# EAGLE design driveher (EAGLE 6.4)
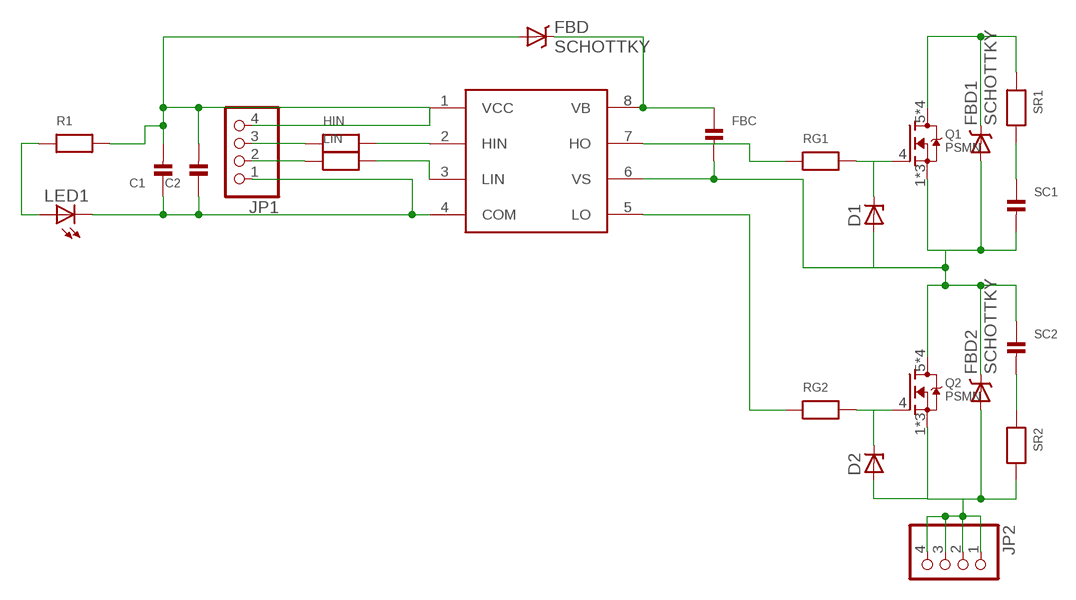
[diagram p0: schematic, sheet 1]

## Parts
C1  CAP_CERAMIC1206  [1206]
C2  CAP_CERAMIC1206  [1206]
D1  ZENER-DIODESOT23  [SOT23]
D2  ZENER-DIODESOT23  [SOT23]
FBC  CAP_CERAMIC1206  [1206]
FBD  SCHOTTKY  [SMA-DIODE]
FBD1  SCHOTTKY  [SMA-DIODE]
FBD2  SCHOTTKY  [SMA-DIODE]
HIN  RESISTOR0603  [0603]
JP1  HEADER-1X4ROUND  [1X04_ROUND]
JP2  HEADER-1X4ROUND  [1X04_ROUND]
LED1  LEDCHIPLED_0603  [CHIPLED_0603]
LIN  RESISTOR0603  [0603]
Q1  PSMN  [SO-08]
Q2  PSMN  [SO-08]
R1  RESISTOR0603  [0603]
RG1  RESISTOR0603  [0603]
RG2  RESISTOR0603  [0603]
SC1  CAP_CERAMIC0603  [0603]
SC2  CAP_CERAMIC0603  [0603]
SR1  RESISTOR0603  [0603]
SR2  RESISTOR0603  [0603]
U$1  IRS218-67  [SO-08]

## Nets
12V: C1.2 C2.2 FBD.A JP1.4 R1.2 U$1.1(VCC)
FLOAT: FBC.1 FBD.C U$1.8(VB)
G1: D1.3(C) Q1.4(G) RG1.2
G2: D2.3(C) Q2.4(G) RG2.2
GND: C1.1 C2.1 D2.1(A) FBD2.A JP1.1 JP2.1 JP2.2 JP2.3 JP2.4 LED1.C Q2.1(S) Q2.2(S) Q2.3(S) SR2.2 U$1.4(COM)
HIN-P: HIN.2 U$1.2(HIN)
HOUT: RG1.1 U$1.7(HO)
LIN-P: LIN.2 U$1.3(LIN)
LOUT: RG2.1 U$1.5(LO)
N$1: LED1.A R1.1
N$2: SC1.1 SR1.2
N$3: HIN.1 JP1.3
N$4: JP1.2 LIN.1
OUT: D1.1(A) FBC.2 FBD1.A FBD2.C Q1.1(S) Q1.2(S) Q1.3(S) Q2.5(D) Q2.6(D) Q2.7(D) Q2.8(D) SC1.2 SC2.1 U$1.6(VS)
P2: SC2.2 SR2.1
V+: FBD1.C Q1.5(D) Q1.6(D) Q1.7(D) Q1.8(D) SR1.1

## Library data of the parts
C1 C2 FBC SC1 SC2 = nonolith:CAP_CERAMIC: Ceramic Capacitors 0402 - 0402 Surface Mount Capacitors 0.1uF 10V 10% [Digikey: 490-1318-2-ND] 0603 - 0603 Surface Mount Capacitors 16 pF 50V 5% [Digikey: 445-5051-2-ND] 22 pF 50V [Digikey: PCC220ACVTR-ND] 33 pF 50V 5% [Digikey: 490-1415-1-ND] 56pF 50V 5% [Digikey: 490-1421-1-ND] 220pF 50V 5% [Digikey: 445-1285-1-ND] 680 pF 50V 2200 pF 50V 5% C0G [Digikey: 445-1297-1-ND] 5600 pF 100V 5% X7R [Digikey: 478-3711-1-ND] 0.1 µF 25V 10% [Digikey: PCC2277TR-ND] 0.22 µF 16V 10% X7R [Digikey: 445-1318-1-ND] 1.0 µF 25V 10% [Digikey: 445-5146-2-ND] 0603 - RF Specific 3pF 250V +/-0.1pF RF [Digikey: 712-1347-1-ND] 18 pF 250V 5% [Digikey: 478-3505-1-ND or 712-1322-1-ND] 56 pF 250V 5% C0G RF [Digikey: 490-4867-1-ND] 68 pF 250V RF [Digikey: 490-4868-1-ND] 0805 - 0805 Surface Mount Capacitors 220 pF 250V 2% RF Ceramic Capacitor [Digikey: 712-1398-1-ND] 1000 pF 50V 2% NP0 Ceramic Capacitor [Digikey: 478-3760-1-ND] 0.1 µF 25V 10% Ceramic Capacitor [Digikey: PCC1828TR-ND] 1.0 µF 16V 10% Ceramic Capacitor[Digikey: 490-1691-2-ND] 10.0 µF 10V 10% Ceramic Capacitor[Digikey: 709-1228-1-ND] 1206 - 1206 Surface Mount Capacitors
D1 D2 = diode:ZENER-DIODE: Z-Diode
FBD FBD1 FBD2 = nonolith:SCHOTTKY: Protection Diode: MBRA140
HIN LIN R1 RG1 RG2 SR1 SR2 = nonolith:RESISTOR: Resistors 0402 - 0402 Surface Mount Package 10.0K 1% 1/16W [Digikey: 311-10.0KLRTR-ND] 0603 - 0603 Surface Mount Package 0 Ohm 1/10 Watt 1% Resistor 15 Ohm 1/10 Watt 1% Resistor 33 Ohm 1/10 Watt 1% Resistor 49.9 Ohm 1/10 Watt 1% Resistor 100 Ohm 1/10 Watt 1% Resistor 150 Ohm 1/10 Watt 1% Resistor 240 Ohm 1/10 Watt 1% Resistor 390 Ohm 1/10 Watt 1% Resistor 560 Ohm 1/10 Watt 1% Resistor 750 Ohm 1/10 Watt 1% Resistor 1.0K Ohm 1/10 Watt 1% Resistor 1.5K Ohm 1/10 Watt 1% Resistor 2.0K Ohm 1/10 Watt 1% Resistor 4.7K Ohm 1/10 Watt 1% Resistor 10.0K Ohm 1/10 Watt 1% Resistor 20.0K Ohm 1/10 Watt 1% Resistor 33.0K Ohm 1/10 Watt 1% Resistor 100.0K Ohm 1/10 Watt 1% Resistor 0805 - 0805 Surface Mount Package 0 Ohm 1/8 Watt 1% Resistor 33 Ohm 1/8 Watt 1% Resistor 100 Ohm 1/8 Watt 1% Resistor 150 Ohm 1/8 Watt 1% Resistor 200 Ohm 1/8 Watt 1% Resistor 240 Ohm 1/8 Watt 1% Resistor 330 Ohm 1/8 Watt 1% Resistor 390 Ohm 1/8 Watt 1% Resistor 470 Ohm 1/8 Watt 1% Resistor 1.0K Ohm 1/8 Watt 1% Resistor 1.5K Ohm 1/8 Watt 1% Resistor 2.0K Ohm 1/8 Watt 1% Resistor 4.7K Ohm 1/8 Watt 1% Resistor 5.1K Ohm 1/8 Watt 1% Resistor 5.6K Ohm 1/8 Watt 1% Resistor 10.0K Ohm 1/8 Watt 1% Resistor 22.0K Ohm 1/8 Watt 1% Resistor 33.0K Ohm 1/8 Watt 1% Resistor 100K Ohm 1/8 Watt 1% Resistor 1206 - 1206 Surface Mount Package
JP1 JP2 = nonolith:HEADER-1X4: PIN HEADER
LED1 = adafruit:LED: LED OSRAM: - CHIPLED LG R971, LG N971, LY N971, LG Q971, LY Q971, LO R971, LY R971 LH N974, LH R974 LS Q976, LO Q976, LY Q976 LO Q996 - Hyper CHIPLED LW Q18S LB Q993, LB Q99A, LB R99A - SideLED LS A670, LO A670, LY A670, LG A670, LP A670 LB A673, LV A673, LT A673, LW A673 LH A674 LY A675 LS A676, LA A676, LO A676, LY A676, LW A676 LS A679, LY A679, LG A679 - Hyper Micro SIDELED® LS Y876, LA Y876, LO Y876, LY Y876 LT Y87S - SmartLED LW L88C, LW L88S LB L89C, LB L89S, LG L890 LS L89K, LO L89K, LY L89K LS L896, LA L896, LO L896, LY L896 - TOPLED LS T670, LO T670, LY T670, LG T670, LP T670 LSG T670, LSP T670, LSY T670, LOP T670, LYG T670 LG T671, LOG T671, LSG T671 LB T673, LV T673, LT T673, LW T673 LH T674 LS T676, LA T676, LO T676, LY T676, LB T676, LH T676, LSB T676, LW T676 LB T67C, LV T67C, LT T67C, LS T67K, LO T67K, LY T67K, LW E67C LS E67B, LA E67B, LO E67B, LY E67B, LB E67C, LV E67C, LT E67C LW T67C LS T679, LY T679, LG T679 LS T770, LO T770, LY T770, LG T770, LP T770 LB T773, LV T773, LT T773, LW T773 LH T774 LS E675, LA E675, LY E675, LS T675 LS T776, LA T776, LO T776, LY T776, LB T776 LHGB T686 LT T68C, LB T68C - Hyper Mini TOPLED® LB M676 - Mini TOPLED Santana® LG M470 LS M47K, LO M47K, LY M47K Source: http://www.osram.convergy.de/
Q1 Q2 = nonolith:PSMN: NXP PSMN family FETs PSMN1R0, PSMN102-200Y, etc.
U$1 = nonolith:IRS218: IRS2186/7 FET Driver in SOIC 4a half-H bootstrapped FET driver

## Board
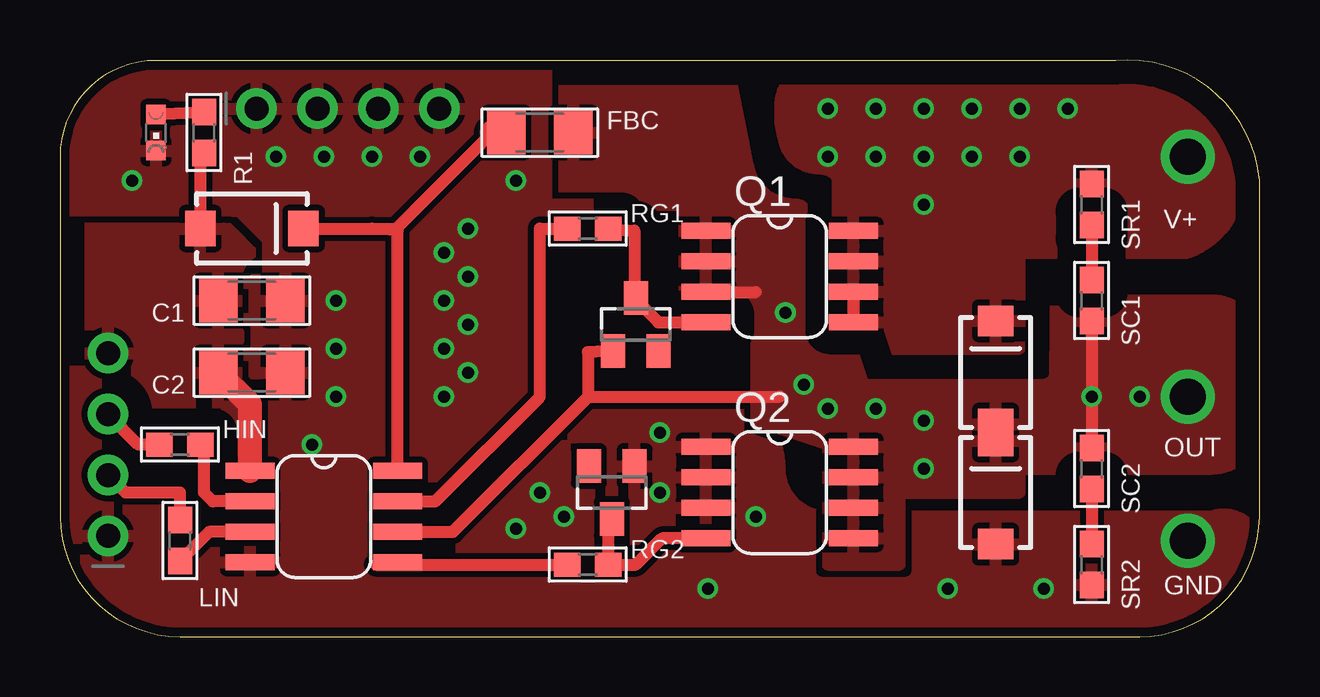
[diagram p1: board, top side]
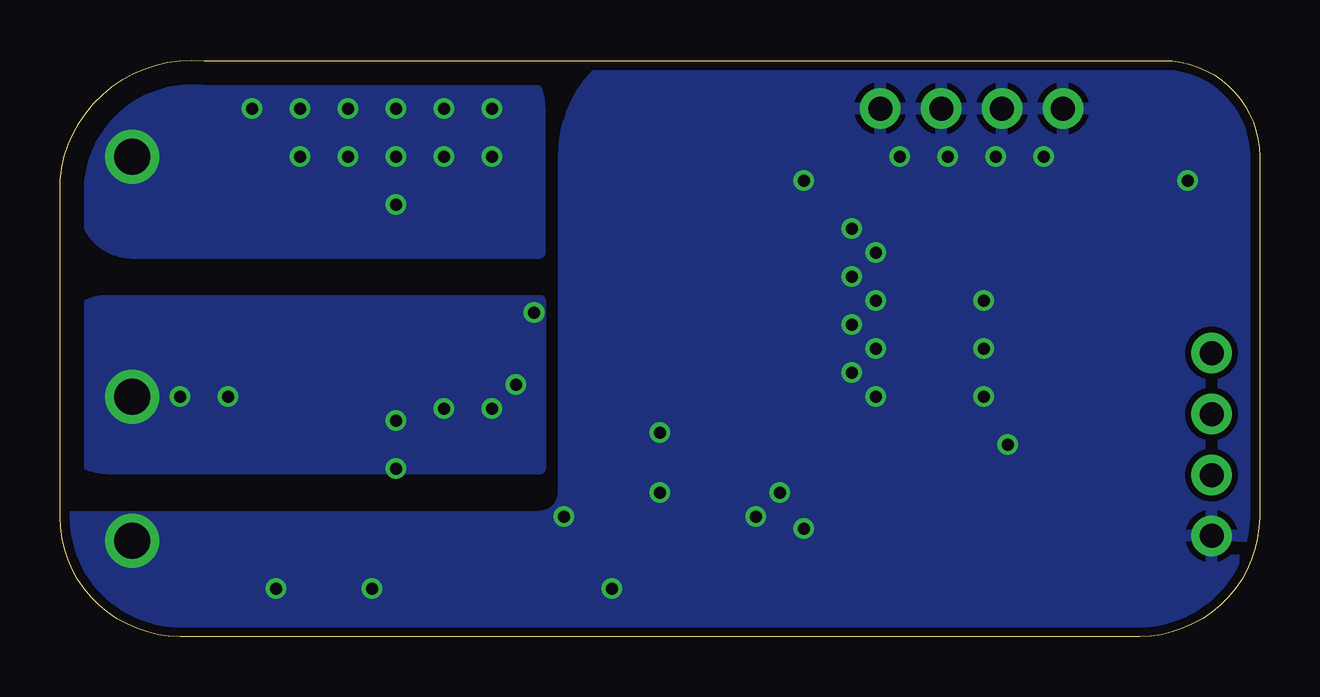
[diagram p2: board, bottom side, seen from below]

Size 50 x 24.02 mm. Coordinates in mm from the lower left corner, seen from the top.
Outline: 44,24 4,24 arc90 0,20 0,5 arc90 5,0 45,0 arc90 50,5 50,19 arc90 44,24
Copper layers (1*16): Top 0.0356mm / dielectric 1.5011mm / Bottom 0.0356mm
Design rules "LaenPCBOrder *": minimum track width 6mil, minimum drill 13mil, track to track 6mil, track to pad 6mil, pad to pad 6mil, via to via 6mil, smd to smd 6mil, copper to edge 15mil, drill to drill 6mil, minimum pad ring 7mil, minimum via ring 7mil, stop-mask expansion 4mil, vias tented up to drill 0.55mm, thermal gap 10mil

### Footprints (pad centres in the part's own frame; a part is rotated, then mirrored left to right if it is on the bottom)
1206 = smd 1.6 x 1.8: 1 -1.4,0; 2 1.4,0
SOT23 = smd 1 x 1.4: 1 -0.95,-1.1; 2 0.95,-1.1; 3 0,1.1
SMA-DIODE = smd 1.27 x 1.47: A -2.15,0; C 2.15,0
0603 = smd 1.1 x 1: 1 -0.85,0; 2 0.85,0
1X04_ROUND = drill 1 pad 1.676: 1 -3.81,0; 2 -1.27,0; 3 1.27,0; 4 3.81,0
CHIPLED_0603 = smd 0.8 x 0.8: A 0,-0.75; C 0,0.75
SO-08 = smd 0.66 x 2.032: 1 -1.905,-3.073; 2 -0.635,-3.073; 3 0.635,-3.073; 4 1.905,-3.073; 5 1.905,3.073; 6 0.635,3.073; 7 -0.635,3.073; 8 -1.905,3.073

### Placement (x,y rotation side)
C1  8,14 180 top
C2  8,11 180 top
D1  24,13 0 top
D2  23,6 180 top
FBC  20,21 0 top
FBD  8,17 0 top
FBD1  39,11 90 top
FBD2  39,6 90 top
HIN  5,8 0 top
JP1  2,8 90 top
JP2  12,22 0 top
LED1  4,21 180 top
LIN  5,4 270 top
Q1  30,15 270 top
Q2  30,6 270 top
R1  6,21 270 top
RG1  22,17 0 top
RG2  22,3 0 top
SC1  43,14 270 top
SC2  43,7 270 top
SR1  43,18 270 top
SR2  43,3 270 top
U$1  11,5 270 top

### Tracks (layer width: path | path; a pad name or v marks a point on that pad's centre or on a via)
12V
  Top 0.5: R1.2 5.85,20 FBD.A
  Top 1: U$1.1 7.93,9.67 C2.2
  pour Top (isolate 1): 1,17 1,10 2,9 5,9 5,7 8,7 8,16 7,17
FLOAT
  Top 0.5: 17.85,21 18,21 14,17 13,17 | FBD.C 13,17 | U$1.8 14.07,16.93 13,17
  Top 1: FBC.1 18,21
G1
  Top 0.5: 23.94,14.1 D1.3 | RG1.2 23.94,16.91 23.94,14.1 | 23.94,14.1 24.95,13.1 Q1.4
G2
  Top 0.5: Q2.4 25.09,4.09 24,3 RG2.2 22.85,4.75 D2.3
GND  (via drill 0.5, 1.5)
  other vias: 47,4 9,20 17,15 13,20 20,6 25,6 27,2 37,2 41,2 17,17 19,19 11,20 17,13 17,11 16,16 16,14 16,12 19,4.5 25,8.5 21,5 16,10 15,20 3,19 11.5,14 29,5 11.5,12 11.5,10 10.5,8
  pour Top (isolate 0.254, rank 6): 5,0 46,0 arc90 50,4 arc90 48,5 32,5 arc-90 30,7 arc90 27,10 25,10 arc-90 22,13 22,22 arc90 19,25 5,25 arc90 0,20 0,5 arc90
  pour Bottom (isolate 0.254, rank 6): 24,25 5,25 arc90 0,20 0,5 arc90 5,0 46,0 arc90 50,5 30,5 arc-90 29,6 29,20 arc90
HIN-P
  Top 0.5: U$1.2 6.37,5.63 6,6 6,7.85 HIN.2
HOUT
  Top 0.5: RG1.1 20,17 20,10 15.63,5.63 U$1.7
LIN-P
  Top 0.5: U$1.3 6.21,4.37 LIN.2
LOUT
  Top 0.5: U$1.5 13.17,3 RG2.1
N$1
  Top 0.5: R1.1 LED1.A
N$2
  Top 0.5: SR1.2 SC1.1
N$3
  Top 0.5: HIN.1 3.27,8 JP1.3
N$4
  Top 0.5: LIN.1 5,6 2.73,6 JP1.2
OUT  (via drill 0.5, 1.5)
  Top 0.5: U$1.6 16.36,4.37 22,10 | 22,10 30,10 | D1.1 22,11.85 22,10 | SC1.2 v43,10 SC2.1 | 28,14.35 29,14.35
  other vias: 47,10 32,9.5 34,9.5 36,9 36,7 45,10 31,10.5 30.24,13.5
  pour Top (isolate 1): 26,18 26,14 29,14 29,9 32,8 32,3 35,3 35,8 34,9 31.11,17.66 arc72 30.64,18 arc-79 28.68,19.61 28,23 21,23 21,18
  pour Top (isolate 1, rank 5): 50,9 50,12 arc90 48,14 41,14 41,11 32,11 32,3 35,3 35,6 40,6 40,7 48,7 arc90
  pour Bottom (isolate 1): 30,7 48,7 arc90 50,9 50,12 arc90 48,14 30,14
P2
  Top 0.5: SC2.2 SR2.1
V+  (via drill 0.5, 1.5)
  Top 0.5: Q1.6 Q1.5
  other vias: 47,20 32,22 32,20 36,20 34,20 34,22 36,22 38,22 38,20 40,20 40,22 42,22 36,18
  pour Top (isolate 1, rank 3): 47,24 32,24 arc90 30,22 30,12 40,12 40,16 47,16 arc90 49,20 49,22 arc90
  pour Bottom (isolate 1): 30,16 30,22 arc-90 32,24 44,24 arc-90 49,19 49,18 arc-90 47,16

### Text on the board
tNames: V+ | OUT | GND